# EAGLE design SuperCapacitor Schmatic V2 (EAGLE 9.5.2)
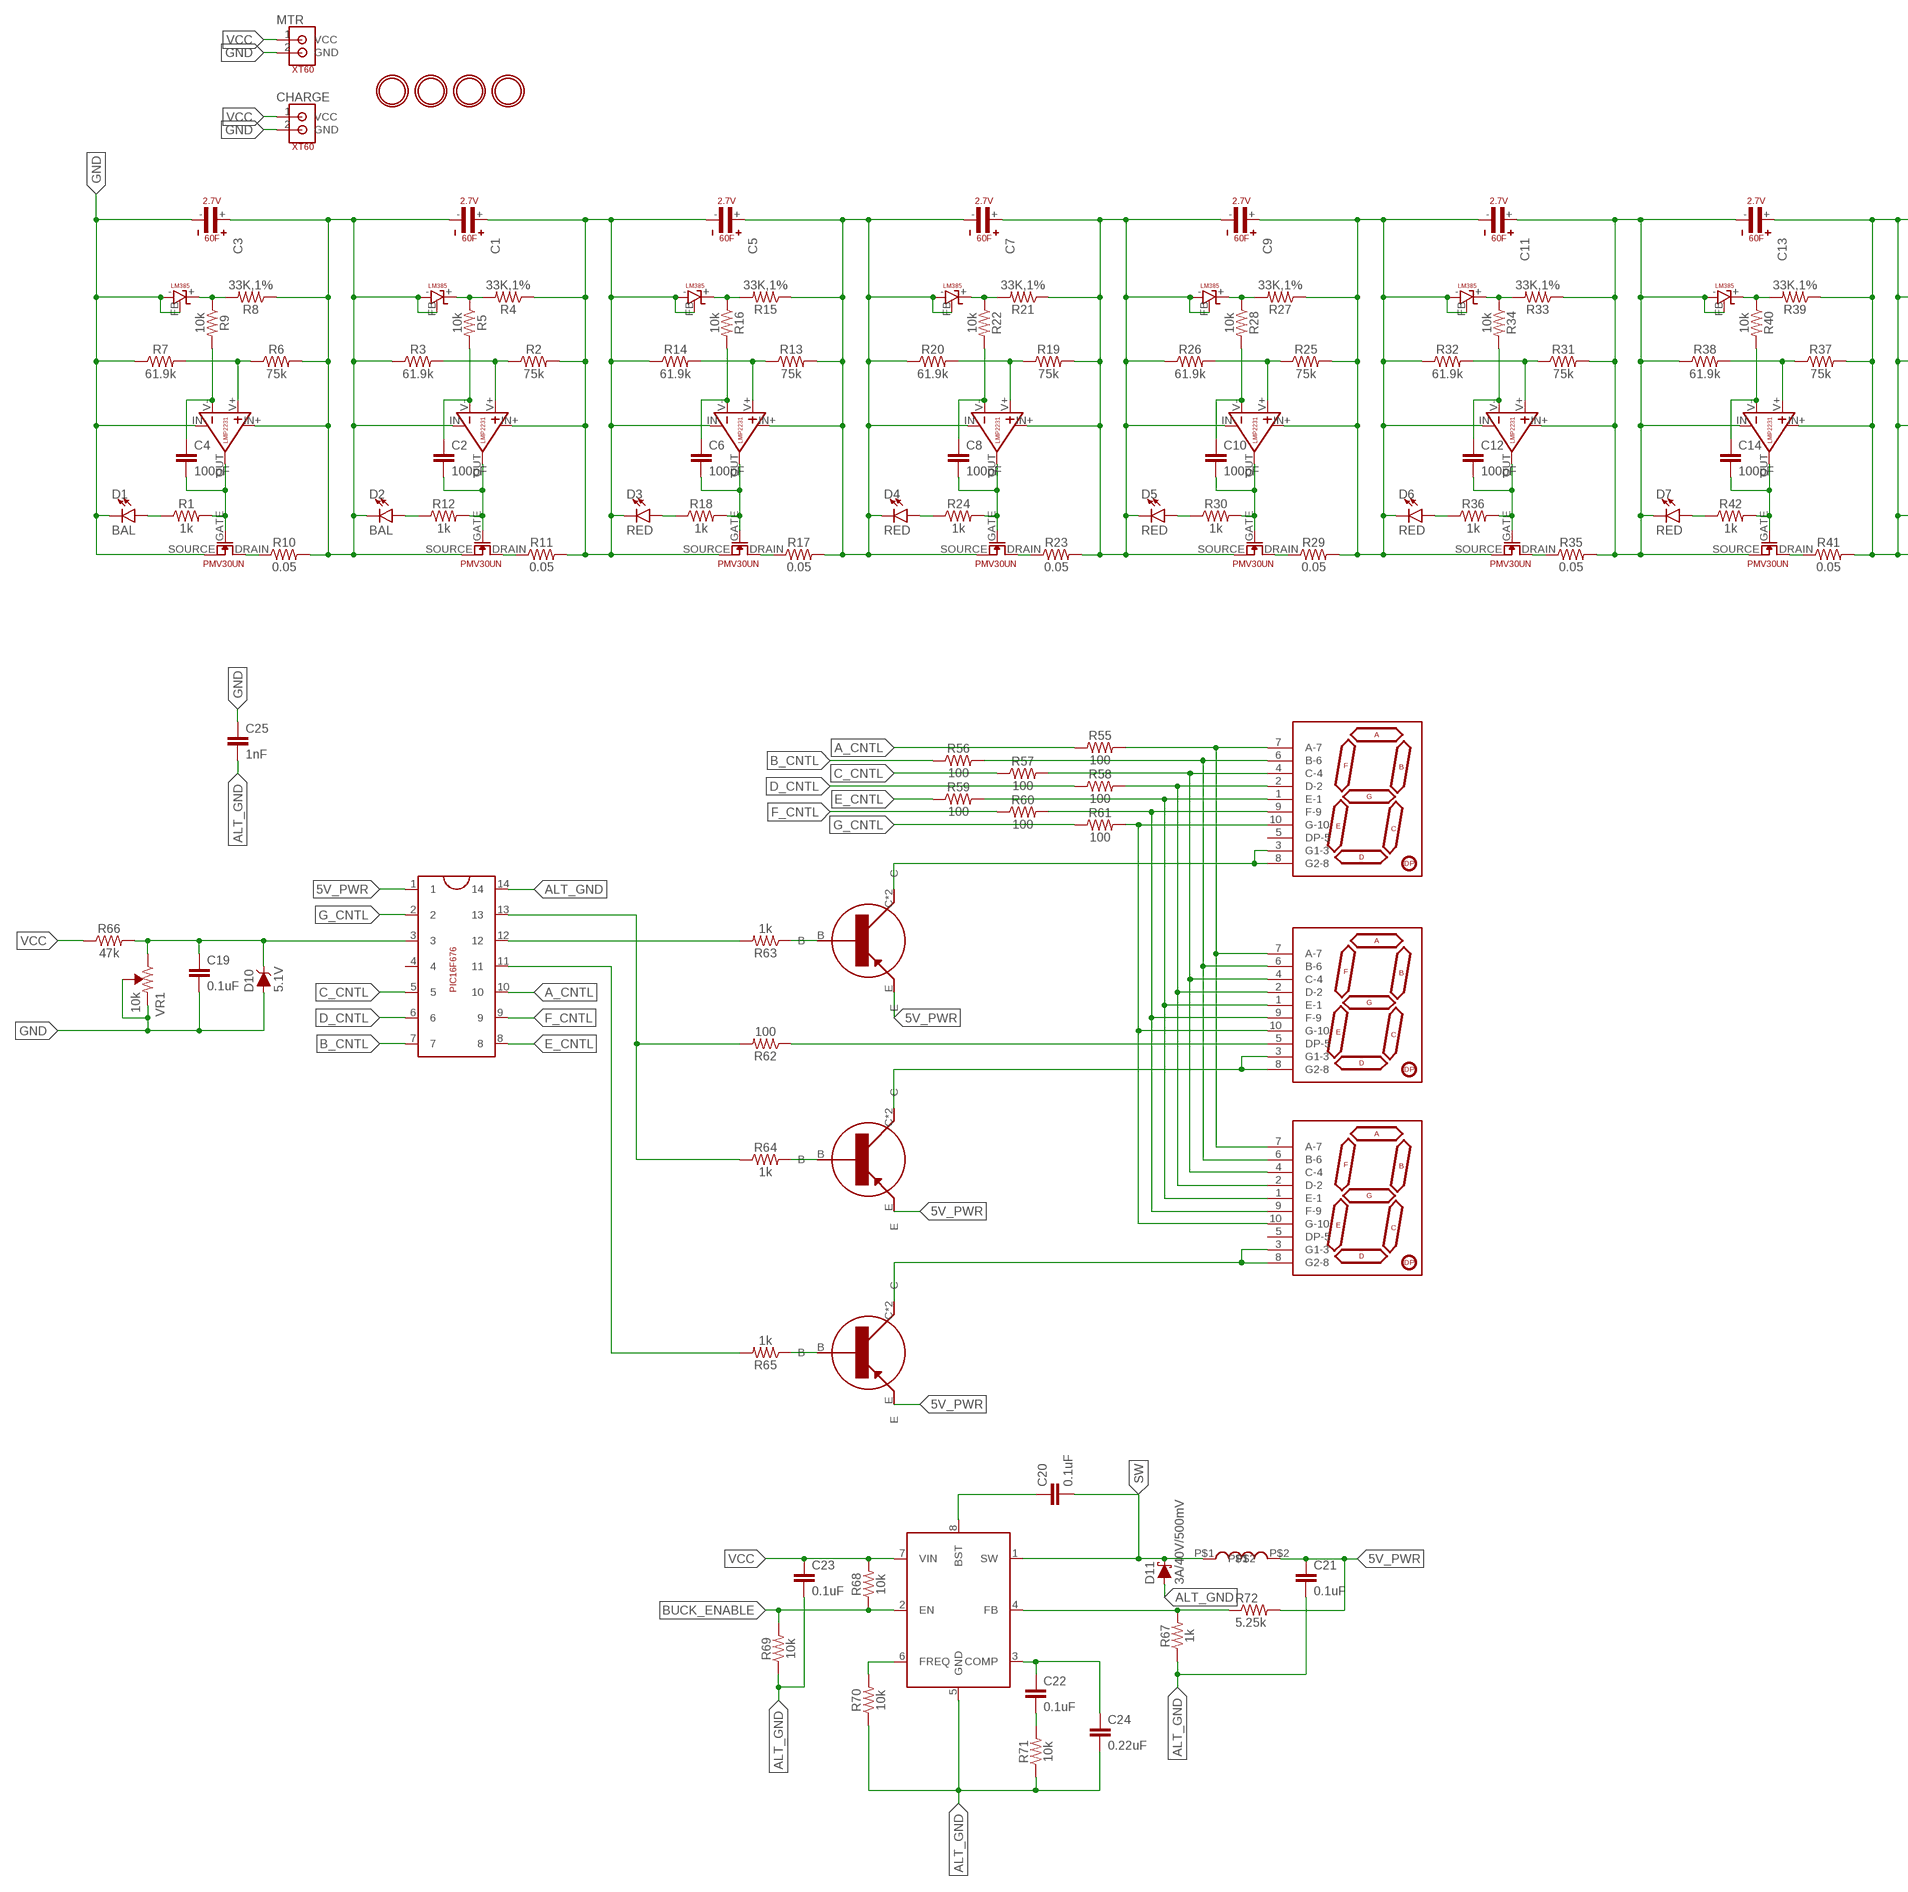
[diagram p0: schematic, sheet 1, part 1 of 2]
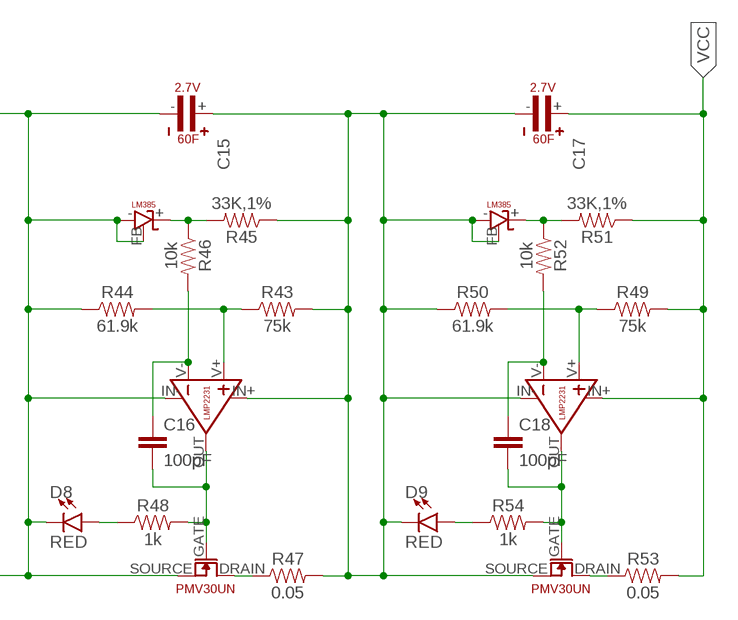
[diagram p1: schematic, sheet 1, part 2 of 2]

## Parts
3.3V_BUCK  SOIC8E  [SOIC127P600X170-9N]
C1  2.7V 60F  2.7V_60F  [2.7V_60F]
C2  100pF  100PF-0603-50V-5%  [0603]
C3  2.7V 60F  2.7V_60F  [2.7V_60F]
C4  100pF  100PF-0603-50V-5%  [0603]
C5  2.7V 60F  2.7V_60F  [2.7V_60F]
C6  100pF  100PF-0603-50V-5%  [0603]
C7  2.7V 60F  2.7V_60F  [2.7V_60F]
C8  100pF  100PF-0603-50V-5%  [0603]
C9  2.7V 60F  2.7V_60F  [2.7V_60F]
C10  100pF  100PF-0603-50V-5%  [0603]
C11  2.7V 60F  2.7V_60F  [2.7V_60F]
C12  100pF  100PF-0603-50V-5%  [0603]
C13  2.7V 60F  2.7V_60F  [2.7V_60F]
C14  100pF  100PF-0603-50V-5%  [0603]
C15  2.7V 60F  2.7V_60F  [2.7V_60F]
C16  100pF  100PF-0603-50V-5%  [0603]
C17  2.7V 60F  2.7V_60F  [2.7V_60F]
C18  100pF  100PF-0603-50V-5%  [0603]
C19  0.1uF  0.1UF-0603-25V-5%  [0603]
C20  0.1uF  0.1UF-0603-25V-(+80/-20%)  [0603]
C21  0.1uF  0.1UF-0603-25V-(+80/-20%)  [0603]
C22  0.1uF  0.1UF-0603-25V-(+80/-20%)  [0603]
C23  0.1uF  0.1UF-0603-25V-(+80/-20%)  [0603]
C24  0.22uF  0.22UF-0603-50V-(-20/+80%)  [0603]
C25  1nF  1.0NF/1000PF-0603-50V-10%  [0603]
CHARGE  XT60  [XT60]
D1  BAL  LED-RED0603  [LED-0603]
D2  BAL  LED-RED0603  [LED-0603]
D3  RED  LED-RED0603  [LED-0603]
D4  RED  LED-RED0603  [LED-0603]
D5  RED  LED-RED0603  [LED-0603]
D6  RED  LED-RED0603  [LED-0603]
D7  RED  LED-RED0603  [LED-0603]
D8  RED  LED-RED0603  [LED-0603]
D9  RED  LED-RED0603  [LED-0603]
D10  5.1V  DIODE-ZENER-MMSZ5232BS  [SOD-323]
D11  3A/40V/500mV  DIODE-SCHOTTKY-B340A  [SMA-DIODE]
MTR  XT60  [XT60]
R1  1k  1KOHM-0603-1/10W-1%  [0603]
R2  75k  75KOHM-0603-1/10W-1%  [0603@1]
R3  61.9k  75KOHM-0603-1/10W-1%  [0603@1]
R4  33K,1%  1MOHM-0603-1/4W-5%  [0603@1]
R5  10k  10KOHM-0603-1/10W-1%  [0603]
R6  75k  75KOHM-0603-1/10W-1%  [0603@1]
R7  61.9k  75KOHM-0603-1/10W-1%  [0603@1]
R8  33K,1%  1MOHM-0603-1/4W-5%  [0603@1]
R9  10k  10KOHM-0603-1/10W-1%  [0603]
R10  0.05  0.05OHM-2512-3W-1%  [2512]
R11  0.05  0.05OHM-2512-3W-1%  [2512]
R12  1k  1KOHM-0603-1/10W-1%  [0603]
R13  75k  75KOHM-0603-1/10W-1%  [0603@1]
R14  61.9k  75KOHM-0603-1/10W-1%  [0603@1]
R15  33K,1%  1MOHM-0603-1/4W-5%  [0603@1]
R16  10k  10KOHM-0603-1/10W-1%  [0603]
R17  0.05  0.05OHM-2512-3W-1%  [2512]
R18  1k  1KOHM-0603-1/10W-1%  [0603]
R19  75k  75KOHM-0603-1/10W-1%  [0603@1]
R20  61.9k  75KOHM-0603-1/10W-1%  [0603@1]
R21  33K,1%  1MOHM-0603-1/4W-5%  [0603@1]
R22  10k  10KOHM-0603-1/10W-1%  [0603]
R23  0.05  0.05OHM-2512-3W-1%  [2512]
R24  1k  1KOHM-0603-1/10W-1%  [0603]
R25  75k  75KOHM-0603-1/10W-1%  [0603@1]
R26  61.9k  75KOHM-0603-1/10W-1%  [0603@1]
R27  33K,1%  1MOHM-0603-1/4W-5%  [0603@1]
R28  10k  10KOHM-0603-1/10W-1%  [0603]
R29  0.05  0.05OHM-2512-3W-1%  [2512]
R30  1k  1KOHM-0603-1/10W-1%  [0603]
R31  75k  75KOHM-0603-1/10W-1%  [0603@1]
R32  61.9k  75KOHM-0603-1/10W-1%  [0603@1]
R33  33K,1%  1MOHM-0603-1/4W-5%  [0603@1]
R34  10k  10KOHM-0603-1/10W-1%  [0603]
R35  0.05  0.05OHM-2512-3W-1%  [2512]
R36  1k  1KOHM-0603-1/10W-1%  [0603]
R37  75k  75KOHM-0603-1/10W-1%  [0603@1]
R38  61.9k  75KOHM-0603-1/10W-1%  [0603@1]
R39  33K,1%  1MOHM-0603-1/4W-5%  [0603@1]
R40  10k  10KOHM-0603-1/10W-1%  [0603]
R41  0.05  0.05OHM-2512-3W-1%  [2512]
R42  1k  1KOHM-0603-1/10W-1%  [0603]
R43  75k  75KOHM-0603-1/10W-1%  [0603@1]
R44  61.9k  75KOHM-0603-1/10W-1%  [0603@1]
R45  33K,1%  1MOHM-0603-1/4W-5%  [0603@1]
R46  10k  10KOHM-0603-1/10W-1%  [0603]
R47  0.05  0.05OHM-2512-3W-1%  [2512]
R48  1k  1KOHM-0603-1/10W-1%  [0603]
R49  75k  75KOHM-0603-1/10W-1%  [0603@1]
R50  61.9k  75KOHM-0603-1/10W-1%  [0603@1]
R51  33K,1%  1MOHM-0603-1/4W-5%  [0603@1]
R52  10k  10KOHM-0603-1/10W-1%  [0603]
R53  0.05  0.05OHM-2512-3W-1%  [2512]
R54  1k  1KOHM-0603-1/10W-1%  [0603]
R55  100  100OHM-0603-1/4W-5%  [0603]
R56  100  100OHM-0603-1/4W-5%  [0603]
R57  100  100OHM-0603-1/4W-5%  [0603]
R58  100  100OHM-0603-1/4W-5%  [0603]
R59  100  100OHM-0603-1/4W-5%  [0603]
R60  100  100OHM-0603-1/4W-5%  [0603]
R61  100  100OHM-0603-1/4W-5%  [0603]
R62  100  100OHM-0603-1/4W-5%  [0603]
R63  1k  1KOHM-0603-1/10W-1%  [0603]
R64  1k  1KOHM-0603-1/10W-1%  [0603]
R65  1k  1KOHM-0603-1/10W-1%  [0603]
R66  47k  47KOHM-0603-1/10W-1%  [0603]
R67  1k  1KOHM-0603-1/10W-1%  [0603]
R68  10k  10KOHM-0603-1/10W-1%  [0603]
R69  10k  10KOHM-0603-1/10W-1%  [0603]
R70  10k  10KOHM-0603-1/10W-1%  [0603]
R71  10k  10KOHM-0603-1/10W-1%  [0603]
R72  5.25k  CRCW08050000Z0EA  [RES_0805]
U$1  LMP2231  [LMP2231_SOT23_5]
U$2  LM385  [LM385_SOT23]
U$3  PMV30UN_MOS  [PMV30UN_SOT23]
U$4  LMP2231  [LMP2231_SOT23_5]
U$5  LM385  [LM385_SOT23]
U$6  PMV30UN_MOS  [PMV30UN_SOT23]
U$7  LMP2231  [LMP2231_SOT23_5]
U$8  LM385  [LM385_SOT23]
U$9  PMV30UN_MOS  [PMV30UN_SOT23]
U$10  LMP2231  [LMP2231_SOT23_5]
U$11  LM385  [LM385_SOT23]
U$12  PMV30UN_MOS  [PMV30UN_SOT23]
U$13  LMP2231  [LMP2231_SOT23_5]
U$14  LM385  [LM385_SOT23]
U$15  PMV30UN_MOS  [PMV30UN_SOT23]
U$16  LMP2231  [LMP2231_SOT23_5]
U$17  LM385  [LM385_SOT23]
U$18  PMV30UN_MOS  [PMV30UN_SOT23]
U$19  LMP2231  [LMP2231_SOT23_5]
U$20  LM385  [LM385_SOT23]
U$21  PMV30UN_MOS  [PMV30UN_SOT23]
U$22  LMP2231  [LMP2231_SOT23_5]
U$23  LM385  [LM385_SOT23]
U$24  PMV30UN_MOS  [PMV30UN_SOT23]
U$25  LMP2231  [LMP2231_SOT23_5]
U$26  LM385  [LM385_SOT23]
U$27  PMV30UN_MOS  [PMV30UN_SOT23]
U$28  PZT3906  [SOT_223]
U$29  PZT3906  [SOT_223]
U$30  M5  [M5]
U$31  M5  [M5]
U$32  M5  [M5]
U$33  M5  [M5]
U$34  PZT3906  [SOT_223]
U$35  DSM7T  [7-SEGMENT_SMD]
U$36  DSM7T  [7-SEGMENT_SMD]
U$37  DSM7T  [7-SEGMENT_SMD]
U$38  PIC16F676  [PIC16F676]
U$39  4.7UH_INDUCTOR  [4.7UH_INDUCTOR]
VR1  10k  TRIMPOT-SMD-3MM-OPEN-1/10W-25%  [TRIMPOT-SMD-TC33X]

## Nets
1 [discharge]: R17.P$1 U$9.DRAIN
5V_PWR: C21.1 R72.2 U$28.E U$29.E U$34.E U$38.1 U$39.P$2
A_CNTL: R55.1 U$38.10
ALT_GND [discharge]: 3.3V_BUCK.5(GND) C21.2 C23.2 C24.2 C25.2 D11.A R67.1 R69.1 R70.1 R71.1 U$38.14
B_CNTL: R56.1 U$38.7
BUCK_ENABLE: 3.3V_BUCK.2(EN) R68.1 R69.2
C_CNTL: R57.1 U$38.5
D_CNTL: R58.1 U$38.6
E_CNTL: R59.1 U$38.8
F_CNTL: R60.1 U$38.9
G_CNTL: R61.1 U$38.2
GND [discharge]: C3.- C19.2 C25.1 CHARGE.2(GND) D1.C D10.A MTR.2(GND) R7.1 U$4.IN- U$5.- U$5.FB U$6.SOURCE VR1.2(WIPER) VR1.3(CCW)
N$1: D1.A R1.1
N$2: U$29.C U$29.C2(C) U$37.3(G1-3) U$37.8(G2-8)
N$3: C2.2 R12.2 U$1.OUT U$3.GATE
N$4 [discharge]: C1.- C3.+ D2.C R3.1 R6.2 R8.1 R10.P$2 U$1.IN- U$2.- U$2.FB U$3.SOURCE U$4.IN+
N$5: R2.1 R3.2 U$1.V+
N$6: C2.1 R5.2 U$1.V-
N$7: R4.2 R5.1 U$2.+
N$8: U$34.C U$34.C2(C) U$36.3(G1-3) U$36.8(G2-8)
N$9: C4.2 R1.2 U$4.OUT U$6.GATE
N$10: R65.1 U$34.B
N$11: R6.1 R7.2 U$4.V+
N$12: C4.1 R9.2 U$4.V-
N$13: R8.2 R9.1 U$5.+
N$14 [discharge]: R10.P$1 U$6.DRAIN
N$15 [discharge]: R11.P$1 U$3.DRAIN
N$16: D2.A R12.1
N$17: R63.1 U$28.B
N$18: C6.2 R18.2 U$7.OUT U$9.GATE
N$19 [discharge]: C1.+ C5.- D3.C R2.2 R4.1 R11.P$2 R14.1 U$1.IN+ U$7.IN- U$8.- U$8.FB U$9.SOURCE
N$20: R13.1 R14.2 U$7.V+
N$21: C6.1 R16.2 U$7.V-
N$22: R15.2 R16.1 U$8.+
N$23: R62.1 U$37.5(DP-5)
N$24: D3.A R18.1
N$25: R62.2 R64.1 U$38.13
N$26: C8.2 R24.2 U$10.OUT U$12.GATE
N$27 [discharge]: C5.+ C7.- D4.C R13.2 R15.1 R17.P$2 R20.1 U$7.IN+ U$10.IN- U$11.- U$11.FB U$12.SOURCE
N$28: R19.1 R20.2 U$10.V+
N$29: C8.1 R22.2 U$10.V-
N$30: R21.2 R22.1 U$11.+
N$31 [discharge]: R23.P$1 U$12.DRAIN
N$32: D4.A R24.1
N$33: R63.2 U$38.12
N$34: C10.2 R30.2 U$13.OUT U$15.GATE
N$35 [discharge]: C7.+ C9.- D5.C R19.2 R21.1 R23.P$2 R26.1 U$10.IN+ U$13.IN- U$14.- U$14.FB U$15.SOURCE
N$36: R25.1 R26.2 U$13.V+
N$37: C10.1 R28.2 U$13.V-
N$38: R27.2 R28.1 U$14.+
N$39 [discharge]: R29.P$1 U$15.DRAIN
N$40: D5.A R30.1
N$41: C19.1 D10.C R66.2 U$38.3 VR1.1(CW)
N$42: C12.2 R36.2 U$16.OUT U$18.GATE
N$43 [discharge]: C9.+ C11.- D6.C R25.2 R27.1 R29.P$2 R32.1 U$13.IN+ U$16.IN- U$17.- U$17.FB U$18.SOURCE
N$44: R31.1 R32.2 U$16.V+
N$45: C12.1 R34.2 U$16.V-
N$46: R33.2 R34.1 U$17.+
N$47 [discharge]: R35.P$1 U$18.DRAIN
N$48: D6.A R36.1
N$49: R65.2 U$38.11
N$50: C14.2 R42.2 U$19.OUT U$21.GATE
N$51 [discharge]: C11.+ C13.- D7.C R31.2 R33.1 R35.P$2 R38.1 U$16.IN+ U$19.IN- U$20.- U$20.FB U$21.SOURCE
N$52: R37.1 R38.2 U$19.V+
N$53: C14.1 R40.2 U$19.V-
N$54: R39.2 R40.1 U$20.+
N$55 [discharge]: R41.P$1 U$21.DRAIN
N$56: D7.A R42.1
N$57: U$28.C U$28.C2(C) U$35.3(G1-3) U$35.8(G2-8)
N$58: C16.2 R48.2 U$22.OUT U$24.GATE
N$59: C13.+ C15.- D8.C R37.2 R39.1 R41.P$2 R44.1 U$19.IN+ U$22.IN- U$23.- U$23.FB U$24.SOURCE
N$60: R43.1 R44.2 U$22.V+
N$61: C16.1 R46.2 U$22.V-
N$62: R45.2 R46.1 U$23.+
N$63 [discharge]: R47.P$1 U$24.DRAIN
N$64: D8.A R48.1
N$65: R64.2 U$29.B
N$66: C18.2 R54.2 U$25.OUT U$27.GATE
N$67 [discharge]: C15.+ C17.- D9.C R43.2 R45.1 R47.P$2 R50.1 U$22.IN+ U$25.IN- U$26.- U$26.FB U$27.SOURCE
N$68: R49.1 R50.2 U$25.V+
N$69: C18.1 R52.2 U$25.V-
N$70: R51.2 R52.1 U$26.+
N$71 [discharge]: R53.P$1 U$27.DRAIN
N$72: D9.A R54.1
N$73: R55.2 U$35.7(A-7) U$36.7(A-7) U$37.7(A-7)
N$74: R56.2 U$35.6(B-6) U$36.6(B-6) U$37.6(B-6)
N$75: R57.2 U$35.4(C-4) U$36.4(C-4) U$37.4(C-4)
N$76: R58.2 U$35.2(D-2) U$36.2(D-2) U$37.2(D-2)
N$77: R59.2 U$35.1(E-1) U$36.1(E-1) U$37.1(E-1)
N$78: R60.2 U$35.9(F-9) U$36.9(F-9) U$37.9(F-9)
N$79: R61.2 U$35.10(G-10) U$36.10(G-10) U$37.10(G-10)
N$81: 3.3V_BUCK.4(FB) R67.2 R72.1
N$82: 3.3V_BUCK.8(BST) C20.1
N$83: 3.3V_BUCK.6(FREQ) R70.2
N$84: 3.3V_BUCK.3(COMP) C22.1 C24.1
N$85: C22.2 R71.2
SW: 3.3V_BUCK.1(SW) C20.2 D11.C U$39.P$1
VCC [discharge]: 3.3V_BUCK.7(VIN) C17.+ C23.1 CHARGE.1(VCC) MTR.1(VCC) R49.2 R51.1 R53.P$2 R66.1 R68.2 U$25.IN+
Unconnected: U$35.5(DP-5) U$36.5(DP-5) U$38.4

## Library data of the parts
3.3V_BUCK = SOIC127P600X170-9N:SOIC8E
C1 C3 C5 C7 C9 C11 C13 C15 C17 = personal Made:2.7V_60F
C2 C4 C6 C8 C10 C12 C14 C16 C18 = SparkFun-Capacitors:100PF: 100pF/0.1nF ceramic capacitors A capacitor is a passive two-terminal electrical component used to store electrical energy temporarily in an electric field.; PROD_ID: CAP-07883
C19 = SparkFun-Capacitors:0.1UF: 0.1µF ceramic capacitors A capacitor is a passive two-terminal electrical component used to store electrical energy temporarily in an electric field.; PROD_ID: CAP-08604
C20-C23 = SparkFun-Capacitors:0.1UF: 0.1µF ceramic capacitors A capacitor is a passive two-terminal electrical component used to store electrical energy temporarily in an electric field.; PROD_ID: CAP-00810
C24 = SparkFun-Capacitors:0.22UF: 0.22µF ceramic capacitors A capacitor is a passive two-terminal electrical component used to store electrical energy temporarily in an electric field.; PROD_ID: CAP-09885
C25 = SparkFun-Capacitors:1.0NF/1000PF: 1nF/1,000pF ceramic capacitors A capacitor is a passive two-terminal electrical component used to store electrical energy temporarily in an electric field.; PROD_ID: CAP-07886
CHARGE MTR = NewKevinMade:XT60
D1 D2 = SparkFun-LED:LED-RED: Red SMD LED Used in manufacturing of most products at SparkFun Packages: 0603 - SMD 0603 package [Product Link] <http://docs.avagotech.com/docs/AV02-0551EN> 0603 SMART - SMD 0603 SMART package ( more efficient and expensive)[Product Link] <http://www.osram-os.com/Graphics/XPic2/00077099_0.pdf> 1206 - SMD1206 package [Product Link] <https://www.sparkfun.com/datasheets/DevTools/LilyPad/Q150OVS4.pdff> SparkFun Products: Pro Mini 328 -5V <https://www.sparkfun.com/products/821> RedBoard <https://www.sparkfun.com/products/12757> IOIO-OTG <https://www.sparkfun.com/products/13613>; PROD_ID: DIO-00819; VALUE: RED
D3-D9 = SparkFun-LED:LED-RED: Red SMD LED Used in manufacturing of most products at SparkFun Packages: 0603 - SMD 0603 package [Product Link] <http://docs.avagotech.com/docs/AV02-0551EN> 0603 SMART - SMD 0603 SMART package ( more efficient and expensive)[Product Link] <http://www.osram-os.com/Graphics/XPic2/00077099_0.pdf> 1206 - SMD1206 package [Product Link] <https://www.sparkfun.com/datasheets/DevTools/LilyPad/Q150OVS4.pdff> SparkFun Products: Pro Mini 328 -5V <https://www.sparkfun.com/products/821> RedBoard <https://www.sparkfun.com/products/12757> IOIO-OTG <https://www.sparkfun.com/products/13613>; PROD_ID: DIO-00819
D10 = SparkFun-DiscreteSemi:DIODE-ZENER: Zener Diode A Zener diode allows current to flow from its anode to its cathode like a normal semiconductor diode, but it also permits current to flow in the reverse direction when its "Zener voltage" is reached. - WIkipedia; PROD_ID: DIO-12442; VALUE: 5.6V
D11 = SparkFun-DiscreteSemi:DIODE-SCHOTTKY: Schottky diode A Schottky diode is a semiconductor diode which has a low forward voltage drop and a very fast switching action.; PROD_ID: DIO-09886
R1 R12 R18 R24 R30 R36 R42 R48 R54 R63-R65 R67 = SparkFun-Resistors:1KOHM: 1kΩ resistor A resistor is a passive two-terminal electrical component that implements electrical resistance as a circuit element. Resistors act to reduce current flow, and, at the same time, act to lower voltage levels within circuits. - Wikipedia; PROD_ID: RES-07856
R2 R3 R6 R7 R13 R14 R19 R20 R25 R26 R31 R32 R37 R38 R43 R44 R49 R50 = SparkFun-Resistors:75KOHM: 75Ω resistor A resistor is a passive two-terminal electrical component that implements electrical resistance as a circuit element. Resistors act to reduce current flow, and, at the same time, act to lower voltage levels within circuits. - Wikipedia; PROD_ID: RES-09737; VALUE: 75
R4 R8 R15 R21 R27 R33 R39 R45 R51 = SparkFun-Resistors:1MOHM: 1MΩ resistor A resistor is a passive two-terminal electrical component that implements electrical resistance as a circuit element. Resistors act to reduce current flow, and, at the same time, act to lower voltage levels within circuits. - Wikipedia; PROD_ID: RES-07868; VALUE: 1M
R5 R9 R16 R22 R28 R34 R40 R46 R52 R68-R71 = SparkFun-Resistors:10KOHM: 10kΩ resistor A resistor is a passive two-terminal electrical component that implements electrical resistance as a circuit element. Resistors act to reduce current flow, and, at the same time, act to lower voltage levels within circuits. - Wikipedia; PROD_ID: RES-00824
R10 R11 R17 R23 R29 R35 R41 R47 R53 = SparkFun-Resistors:0.05OHM: 0.05Ω resistor A resistor is a passive two-terminal electrical component that implements electrical resistance as a circuit element. Resistors act to reduce current flow, and, at the same time, act to lower voltage levels within circuits. - Wikipedia; PROD_ID: RES-13771
R55-R62 = SparkFun-Resistors:100OHM: 100Ω resistor A resistor is a passive two-terminal electrical component that implements electrical resistance as a circuit element. Resistors act to reduce current flow, and, at the same time, act to lower voltage levels within circuits. - Wikipedia; PROD_ID: RES-12438
R66 = SparkFun-Resistors:47KOHM: 47kΩ resistor A resistor is a passive two-terminal electrical component that implements electrical resistance as a circuit element. Resistors act to reduce current flow, and, at the same time, act to lower voltage levels within circuits. - Wikipedia; PROD_ID: RES-07871
R72 = Resistor_Capacitor:CRCW08050000Z0EA: RES SMD 0 OHM JUMPER 1/8W 0805 Manufacturer's datasheet <http://www.vishay.com/docs/20035/dcrcwe3.pdf>; CREATED_BY: PCBLayout.com; DIGIKEY_PART_NUMBER: 541-0.0ATR-ND; MANUFACTURER: Vishay Dale; MPN: CRCW08050000Z0EA; PACKAGE: SMD 0805
U$1 U$4 U$7 U$10 U$13 U$16 U$19 U$22 U$25 = personal Made:LMP2231
U$2 U$5 U$8 U$11 U$14 U$17 U$20 U$23 U$26 = personal Made:LM385
U$3 U$6 U$9 U$12 U$15 U$18 U$21 U$24 U$27 = personal Made:PMV30UN_MOS
U$28 U$29 U$34 = Custom:PZT3906
U$30-U$33 = NewKevinMade:M5
U$35-U$37 = Custom:DSM7T
U$38 = Custom:PIC16F676
U$39 = Custom:4.7UH_INDUCTOR
VR1 = SparkFun-Resistors:TRIMPOT: Trimming Potentiometer (Trimpot) Three-terminal potentiometers, with an adjustable wiper and two adjustable resistors. A pot can be used to create a configurable voltage divider, or as a variable resistor. "Trimpots" are a subset of potentiometers, usually intended for "set-and-forget" applications. They're often more delicate than standard potentiometers - rated for fewer turns. Variants PTH-KNOB - PTH Trimpot w/ finger-adjustable knob Trimpot 10K with Knob <https://www.sparkfun.com/products/9806> (COM-09806) Datasheet <http://www.sparkfun.com/datasheets/Components/General/TSR-3386.pdf> SMD-3MM-CLOSED-FRAME - SMD 3mm Square Closed-Frame Trimpot Used on e.g. EasyDriver - Stepper Motor Driver <https://www.sparkfun.com/products/12779> Datasheet <http://www.bitechnologies.com/pdfs/22.pdf> (22AR10KTR) SMD-5MM - SMD 5mm Square Closed-Frame Trimpot Used on e.g. IOIO-OTG - V2.2 <https://www.sparkfun.com/products/13613> Datasheet <http://www.vishay.com/docs/51008/ts53.pdf> (TS53YL502MR10) SMD-3MM-1/10W-25% - 3mm Square Open-Frame Trimpot Used on e.g. SparkFun Shapeoko <https://www.sparkfun.com/products/13899> Datasheet <http://www.bourns.com/docs/Product-Datasheets/TC33.pdf> (TC33X-2-103E); PROD_ID: RES-12428

## Net classes
1 discharge: width 0.305 mm, drill 0.305 mm, clearance 0.152 mm

## Board
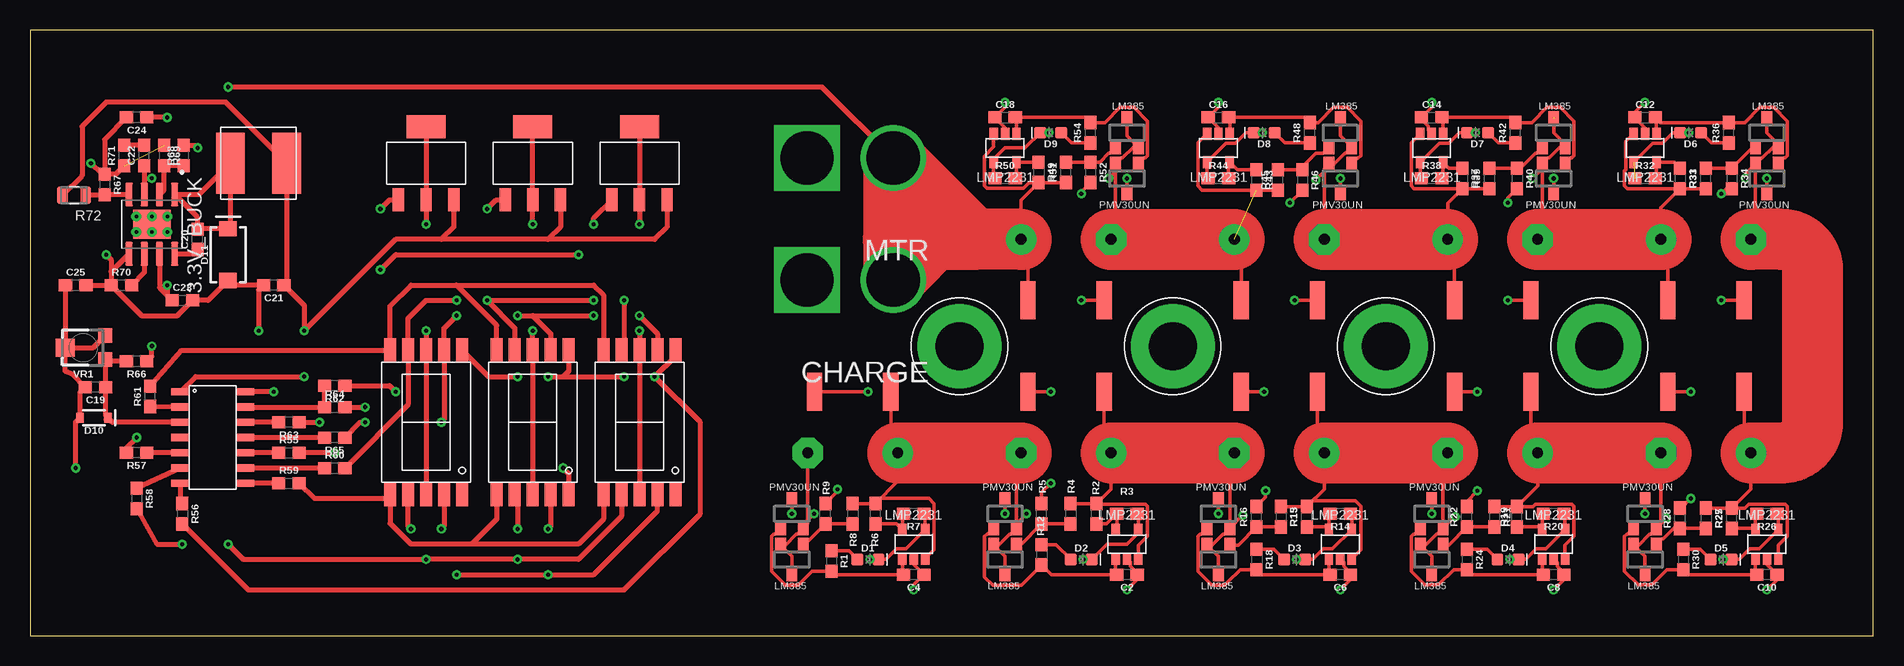
[diagram p2: board, top side]
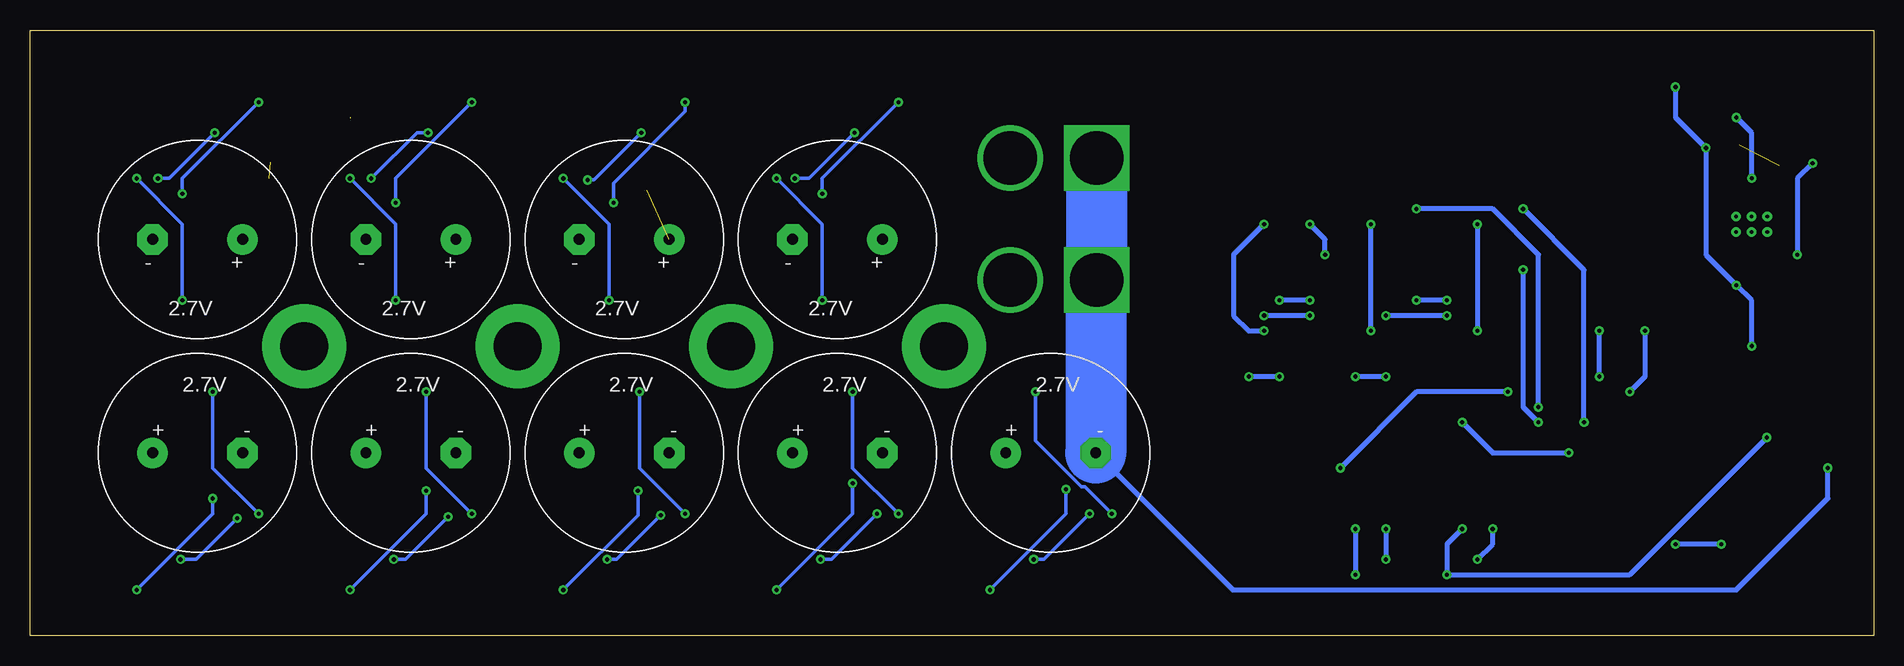
[diagram p3: board, bottom side, seen from below]

Size 153.65 x 50.47 mm. Coordinates in mm from the lower left corner, seen from the top.
Outline: 0,0 153.65,0 153.65,50.47 0,50.47 0,0
Copper layers (1*16): Top 0.035mm / dielectric 1.5mm / Bottom 0.035mm
Design rules "default": minimum track width 6mil, minimum drill 0.35mm, track to track 6mil, track to pad 6mil, pad to pad 6mil, via to via 6mil, smd to smd 6mil, copper to edge 40mil, drill to drill 6mil, minimum pad ring 10mil, minimum via ring 8mil, stop-mask expansion 4mil, vias tented up to drill 0mil, thermal gap 10mil

### Footprints (pad centres in the part's own frame; a part is rotated, then mirrored left to right if it is on the bottom)
SOIC127P600X170-9N = smd 1.97 x 0.6: 1 -2.475,1.905; 2 -2.475,0.635; 3 -2.475,-0.635; 4 -2.475,-1.905; 5 2.475,-1.905; 6 2.475,-0.635; 7 2.475,0.635; 8 2.475,1.905 | smd 2.4 x 3.1: 9 0,0 | drill 0.3 pad 0.4: V1 -0.65,1.3; V2 0.65,1.3; V3 -0.65,0; V4 0.65,0; V5 -0.65,-1.3; V6 0.65,-1.3
2.7V_60F = drill 0.9 pad 2.54: + -3.75,0 | drill 0.9 pad 2.54 octagon: - 3.75,0
0603 = smd 1.1 x 1: 1 -0.85,0; 2 0.85,0
XT60 = drill 4.45: 1 -7.2,7.2 | drill 4.45 square: 2 0,7.2
LED-0603 = smd 1 x 1: A -0.877,0; C 0.877,0
SOD-323 = smd 0.63 x 0.83: A 1.15,0; C -1.15,0
SMA-DIODE = smd 1.27 x 1.47: A -2.15,0; C 2.15,0
0603@1 = smd 1.1 x 1: 1 -0.85,0; 2 0.85,0
2512 = smd 1.27 x 3.175: P$1 -3.175,0; P$2 3.175,0
RES_0805 = smd 0.87 x 1.42: 1 -0.975,0; 2 0.975,0
LMP2231_SOT23_5 = smd 0.7 x 1: IN+ 0.95,-1.2; IN- 0.95,1.2; OUT -0.95,-1.2; V+ -0.95,1.2; V- 0,-1.2
LM385_SOT23 = smd 0.9 x 1.2: + -0.95,-1.2; - 0.95,-1.2; FB 0,1.2
PMV30UN_SOT23 = smd 0.9 x 1.2: DRAIN 0,1.2; GATE -0.95,-1.2; SOURCE 0.95,-1.2
SOT_223 = smd 0.95 x 1.9: B -2.3,-3.05; C 0,-3.05; E 2.3,-3.05 | smd 3.25 x 1.9: C2 0,3.05
M5 = drill 4 pad 7: P$1 0,0
7-SEGMENT_SMD = smd 1 x 2: 1 -3,-6; 2 -1.5,-6; 3 0,-6; 4 1.5,-6; 5 3,-6; 6 3,6; 7 1.5,6; 8 0,6; 9 -1.5,6; 10 -3,6
PIC16F676 = smd 0.6 x 1.5: 1 -3.81,-2.7; 2 -2.54,-2.7; 3 -1.27,-2.7; 4 0,-2.7; 5 1.27,-2.7; 6 2.54,-2.7; 7 3.81,-2.7; 8 3.81,2.7; 9 2.54,2.7; 10 1.27,2.7; 11 0,2.7; 12 -1.27,2.7; 13 -2.54,2.7; 14 -3.81,2.7
4.7UH_INDUCTOR = smd 2.4 x 5.1: P$1 -2.35,0; P$2 2.35,0
TRIMPOT-SMD-TC33X = smd 1.2 x 1.2: 1 -1,-1.825; 3 1,-1.825 | smd 1.5 x 1.6: 2 0,1.5

### Placement (x,y rotation side)
3.3V_BUCK  10.16,34.29 270 top
C1  86.36,15.24 0 bottom
C2  91.44,5.08 180 top
C3  68.58,15.24 0 bottom
C4  73.66,5.08 180 top
C5  104.14,15.24 0 bottom
C6  109.22,5.08 180 top
C7  121.92,15.24 0 bottom
C8  127,5.08 180 top
C9  139.7,15.24 0 bottom
C10  144.78,5.08 180 top
C11  139.7,33.02 180 bottom
C12  134.62,43.18 0 top
C13  121.92,33.02 180 bottom
C14  116.84,43.18 0 top
C15  104.14,33.02 180 bottom
C16  99.06,43.18 0 top
C17  86.36,33.02 180 bottom
C18  81.28,43.18 0 top
C19  5.46,20.7 180 top
C20  13.97,33.02 90 top
C21  20.32,29.21 180 top
C22  9.53,40.01 90 top
C23  12.7,27.94 0 top
C24  8.89,43.18 180 top
C25  3.81,29.21 0 top
CHARGE  64.77,36.83 180 top
D1  69.85,6.35 0 top
D2  87.63,6.35 0 top
D3  105.41,6.35 0 top
D4  123.19,6.35 0 top
D5  140.97,6.35 0 top
D6  138.43,41.91 180 top
D7  120.65,41.91 180 top
D8  102.87,41.91 180 top
D9  85.09,41.91 180 top
D10  5.33,18.16 180 top
D11  16.51,31.75 90 top
MTR  64.77,46.99 180 top
R1  66.8,6.22 270 top
R2  88.9,10.16 90 top
R3  91.44,10.16 180 top
R4  86.74,10.16 270 top
R5  84.33,10.16 90 top
R6  70.48,10.16 90 top
R7  73.66,10.16 180 top
R8  68.58,10.16 270 top
R9  66.29,10.16 90 top
R10  68.58,20.32 0 top
R11  86.36,20.32 0 top
R12  84.33,6.73 270 top
R13  106.43,9.91 90 top
R14  109.22,10.16 180 top
R15  104.27,9.91 270 top
R16  102.23,9.91 90 top
R17  104.14,20.32 0 top
R18  102.23,6.35 270 top
R19  123.95,9.91 90 top
R20  127,10.16 180 top
R21  122.05,9.91 270 top
R22  119.76,9.91 90 top
R23  121.92,20.32 0 top
R24  119.76,6.35 270 top
R25  141.86,9.78 90 top
R26  144.78,10.16 180 top
R27  139.7,9.78 270 top
R28  137.54,9.78 90 top
R29  139.7,20.32 0 top
R30  137.79,6.35 270 top
R31  137.54,38.1 270 top
R32  134.62,38.1 0 top
R33  139.7,38.1 90 top
R34  141.86,38.1 270 top
R35  139.7,27.94 180 top
R36  141.6,41.91 90 top
R37  119.38,38.1 270 top
R38  116.84,38.1 0 top
R39  121.67,38.1 90 top
R40  123.95,38.1 270 top
R41  121.92,27.94 180 top
R42  123.83,41.91 90 top
R43  102.23,37.97 270 top
R44  99.06,38.1 0 top
R45  104.01,37.97 90 top
R46  106.05,37.97 270 top
R47  104.14,27.94 180 top
R48  106.68,41.91 90 top
R49  84.07,38.61 270 top
R50  81.28,38.1 0 top
R51  86.36,38.61 90 top
R52  88.39,38.61 270 top
R53  86.36,27.94 180 top
R54  88.39,41.91 90 top
R55  21.59,15.24 0 top
R56  12.7,10.16 270 top
R57  8.89,15.24 180 top
R58  8.89,11.43 270 top
R59  21.59,12.7 0 top
R60  25.4,13.97 0 top
R61  10.03,19.94 90 top
R62  25.4,20.83 180 top
R63  21.59,17.78 180 top
R64  25.4,19.05 0 top
R65  25.4,16.51 180 top
R66  8.89,22.86 180 top
R67  6.22,37.59 270 top
R68  12.83,40.01 90 top
R69  11.18,40.01 270 top
R70  7.62,29.21 0 top
R71  7.87,40.01 90 top
R72  3.68,36.7 180 top
U$1  91.44,7.62 0 top
U$2  81.28,6.35 180 top
U$3  81.28,10.16 0 top
U$4  73.66,7.62 0 top
U$5  63.5,6.35 180 top
U$6  63.5,10.16 0 top
U$7  109.22,7.62 0 top
U$8  99.06,6.35 180 top
U$9  99.06,10.16 0 top
U$10  127,7.62 0 top
U$11  116.84,6.35 180 top
U$12  116.84,10.16 0 top
U$13  144.78,7.62 0 top
U$14  134.62,6.35 180 top
U$15  134.62,10.16 0 top
U$16  134.62,40.64 180 top
U$17  144.78,41.91 0 top
U$18  144.78,38.1 180 top
U$19  116.84,40.64 180 top
U$20  127,41.91 0 top
U$21  127,38.1 180 top
U$22  99.06,40.64 180 top
U$23  109.22,41.91 0 top
U$24  109.22,38.1 180 top
U$25  81.28,40.64 180 top
U$26  91.44,41.91 0 top
U$27  91.44,38.1 180 top
U$28  33.02,39.37 0 top
U$29  41.91,39.37 0 top
U$30  113.03,24.13 0 top
U$31  130.81,24.13 0 top
U$32  77.47,24.13 0 top
U$33  95.25,24.13 0 top
U$34  50.8,39.37 0 top
U$35  33.02,17.78 0 top
U$36  50.8,17.78 0 top
U$37  41.91,17.78 0 top
U$38  15.24,16.51 270 top
U$39  19.05,39.37 0 top
VR1  4.45,24 90 top

### Tracks (layer width: path | path; a pad name or v marks a point on that pad's centre or on a via)
1  (via drill 0.35)
  Top 0.305: U$9.DRAIN v99.06,10.16 | v102.87,20.32 R17.P$1
  Bottom 0.305: v99.06,10.16 102.87,13.97 v102.87,20.32
5V_PWR  (via drill 0.35)
  Top 0.406: U$38.1 13.81,21.59 v22.86,21.59 | U$34.E 53.1,34.05 52.07,33.02 43.18,33.02 | 43.18,33.02 34.29,33.02 | 34.29,33.02 30.48,33.02 v22.86,25.4 22.86,27.52 C21.1 21.4,29.44 U$39.P$2 | U$28.E 35.32,34.05 34.29,33.02 | U$29.E 44.21,34.05 43.18,33.02 | R72.2 4.35,38.34 4.35,42.45 6.35,44.45 16.32,44.45 U$39.P$2 | 21.4,39.56 U$39.P$2
  Bottom 0.406: v22.86,21.59 v22.86,25.4
A_CNTL
  Top 0.406: R55.1 U$38.10
ALT_GND  (via drill 0.35)  (1 unrouted)
  Top 0.406: 3.3V_BUCK.5 6.77,30.33 | 6.77,30.33 R70.1 | R70.1 9.31,26.67 12.28,26.67 C23.2 14.85,27.94 D11.A 16.9,29.21 C21.2 19.05,28.79 v19.05,25.4 | R67.1 6.01,38.44 v5.08,39.37 | v6.35,31.75 6.77,31.33 6.77,30.33 | R71.1 7.16,38.44 R67.1 | C24.2 6.22,41.36 R67.1 | v20.32,20.32 U$38.14 | C25.2 R70.1
  Bottom 0.406: v5.08,39.37 6.35,38.1 v6.35,31.75 | v19.05,25.4 19.05,21.59 v20.32,20.32
B_CNTL
  Top 0.406: U$38.7 12.54,11.17 R56.1
BUCK_ENABLE
  Top 0.406: 3.3V_BUCK.2 11.18,37.15 R69.2 R68.1
C_CNTL
  Top 0.406: U$38.5 R57.1
D_CNTL
  Top 0.406: U$38.6 R58.1
E_CNTL
  Top 0.406: R59.1 U$38.8
F_CNTL
  Top 0.406: R60.1 U$38.9
G_CNTL
  Top 0.406: U$38.2 R61.1
GND  (via drill 0.35)
  Top 0.305: C3.- 64.83,9.34 U$6.SOURCE | U$6.SOURCE 63.95,8.46 63.87,8.46 62.97,7.55 U$5.- 63.5,6.6 U$5.FB | U$6.SOURCE 64.45,9.27 v65.34,10.16 | v70,6.35 D1.C 71.36,6.35 72.23,7.22 73.02,7.22 U$4.IN- 74.61,10.06 R7.1
  Top 0.406: VR1.2 2.94,22.01 3.03,22 3.55,21.76 C19.2 4.18,20.27 D10.A 3.81,17.79 v3.81,13.97 | VR1.3 5.27,24 VR1.2 | C25.1 2.94,29.2 VR1.2
  Bottom 0.305: v65.34,10.16 69.15,6.35 v70,6.35
  Bottom 0.406: C3.- 53.4,3.81 11.43,3.81 3.81,11.43 v3.81,13.97
  Bottom 5.08: MTR.2 CHARGE.2 64.83,29.57 C3.-
N$1
  Top 0.305: R1.1 68.25,7.07 D1.A
N$2  (via drill 0.35)
  Top 0.406: U$37.3 U$37.8 v41.91,25.4 | v41.91,34.29 U$29.C U$29.C2
  Bottom 0.406: v41.91,25.4 v41.91,34.29
N$3
  Top 0.305: U$3.GATE 79.83,8.46 79.75,8.46 79.58,8.28 79.58,4.88 80.26,4.19 82.64,4.19 R12.2 85.13,5.08 C2.2 90.49,5.18 U$1.OUT
N$4  (via drill 0.35)
  Top 0.305: R10.P$2 71.75,15.81 C3.+ 72.33,12.86 R6.2 | U$3.SOURCE 81.72,8.46 81.65,8.46 80.75,7.55 U$2.- 81.28,6.6 U$2.FB | U$3.SOURCE 82.23,14.86 C1.- | R6.2 R8.1 | R6.2 70.91,11.43 74.93,11.43 75.36,10.99 75.36,7.17 U$4.IN+ | R3.1 92.39,10.06 U$1.IN- 92.39,8.57 91.44,7.62 89.78,7.62 D2.C v87.78,6.35 | v83.06,10.16 82.23,9.33 U$3.SOURCE
  Top 5.08: C3.+ C1.-
  Bottom 0.305: v87.78,6.35 86.87,6.35 v83.06,10.16
N$5
  Top 0.305: R2.1 89.74,9.31 R3.2 90.59,8.92 U$1.V+
N$6  (via drill 0.35)
  Top 0.305: U$1.V- 91.73,6.12 91.73,5.79 92.29,5.24 C2.1 92.29,4.66 v91.44,3.81 | v85.09,12.7 84.33,11.94 R5.2
  Bottom 0.305: v91.44,3.81 85.09,10.16 v85.09,12.7
N$7
  Top 0.305: R4.2 R5.1 82.57,7.55 U$2.+
N$8  (via drill 0.35)
  Top 0.406: U$36.3 U$36.8 v50.8,25.4 | U$34.C2 U$34.C v50.8,34.29
  Bottom 0.406: v50.8,25.4 52.07,25.4 53.34,26.67 53.34,31.75 v50.8,34.29
N$9
  Top 0.305: U$6.GATE 62.05,8.46 61.97,8.46 61.8,8.28 61.8,5.37 62.92,4.25 62.94,4.25 62.99,4.19 64.02,4.19 64.25,4.42 64.25,4.44 65.19,5.37 R1.2 67.09,5.08 C4.2 72.71,5.18 U$4.OUT
N$10  (via drill 0.35)
  Top 0.406: R65.1 27.52,17.78 v27.94,17.78 | v29.21,30.48 30.48,31.75 v45.72,31.75 | v46.99,34.29 46.99,34.81 U$34.B
  Bottom 0.406: v27.94,17.78 29.21,19.05 v29.21,30.48 | v45.72,31.75 45.72,33.02 v46.99,34.29
N$11
  Top 0.305: R6.1 72.22,9.31 U$4.V+ 72.71,10.06 R7.2
N$12  (via drill 0.35)
  Top 0.305: U$4.V- 73.66,5.93 C4.1 73.66,4.23 v73.66,3.81 | v67.31,12.19 67.31,12.03 R9.2
  Bottom 0.305: v73.66,3.81 67.31,10.16 v67.31,12.19
N$13
  Top 0.305: R8.2 R9.1 64.53,7.55 U$5.+
N$14  (via drill 0.35)
  Top 0.305: U$6.DRAIN v63.5,10.16 | v69.85,20.32 R10.P$1
  Bottom 0.305: v63.5,10.16 65.73,12.39 66.01,12.39 69.85,16.24 v69.85,20.32
N$15  (via drill 0.35)
  Top 0.305: R11.P$1 v85.09,20.32 | v81.28,10.16 U$3.DRAIN
  Bottom 0.305: v85.09,20.32 85.09,13.97 v81.28,10.16
N$16
  Top 0.305: R12.1 85.52,7.58 D2.A
N$17  (via drill 0.35)
  Top 0.406: R63.1 v24.13,17.78 | v29.21,35.56 29.97,36.32 U$28.B
  Bottom 0.406: v24.13,17.78 24.13,30.48 v29.21,35.56
N$18
  Top 0.305: U$9.GATE 97.61,8.46 97.53,8.46 97.36,8.28 97.36,5.37 98.48,4.25 98.62,4.25 98.68,4.19 99.58,4.19 99.81,4.42 99.81,4.44 100.88,5.5 R18.2 102.66,5.08 C6.2 108.27,5.18 U$7.OUT
N$19  (via drill 0.35)
  Top 0.305: R11.P$2 89.53,15.81 C1.+ 90.11,12.22 R2.2 | U$9.SOURCE 100.01,14.86 C5.- | U$9.SOURCE 99.5,8.46 99.43,8.46 98.53,7.55 U$8.- 99.06,6.6 U$8.FB | R4.1 R2.2 | R2.2 88.94,10.96 92.97,10.96 93.14,10.79 93.14,8.29 92.39,7.54 U$1.IN+ | R14.1 110.17,10.06 U$7.IN- 108.58,7.22 107.79,7.22 106.92,6.35 D3.C v105.56,6.35 | U$9.SOURCE v101.08,10.03 v101.09,10.03
  Top 5.08: C1.+ C5.-
  Bottom 0.305: v101.09,10.03 104.78,6.35 v105.56,6.35
N$20
  Top 0.305: R14.2 108.27,10.06 U$7.V+ 108.03,9.06 R13.1
N$21  (via drill 0.35)
  Top 0.305: U$7.V- 109.52,6.12 109.52,5.79 110.07,5.24 C6.1 110.07,4.66 v109.22,3.81 | v103,12.06 103,11.52 R16.2
  Bottom 0.305: v109.22,3.81 103,10.03 v103,12.06
N$22
  Top 0.305: R15.2 R16.1 100.73,7.55 U$8.+
N$23  (via drill 0.35)
  Top 0.406: R62.1 29.97,20.83 v30.48,20.32 | v44.45,13.97 44.91,13.51 U$37.5
  Bottom 0.406: v30.48,20.32 38.1,20.32 v44.45,13.97
N$24
  Top 0.305: R18.1 103.68,7.2 D3.A
N$25
  Top 0.406: U$38.13 R64.1 R62.2
N$26
  Top 0.305: U$10.OUT 126.05,5.18 C8.2 120.18,5.08 R24.2 118.67,5.5 117.42,4.25 116.26,4.25 115.14,5.37 115.14,8.28 115.31,8.46 115.39,8.46 U$12.GATE
N$27  (via drill 0.35)
  Top 0.305: R17.P$2 107.31,15.81 C5.+ 107.89,12.22 R13.2 | U$12.SOURCE 117.28,8.46 117.21,8.46 116.31,7.55 U$11.- 116.84,6.6 U$11.FB | U$12.SOURCE 117.79,14.86 C7.- | R13.2 R15.1 | R13.2 107.1,11.43 | U$7.IN+ 110.92,7.17 110.92,10.79 110.49,11.22 106.89,11.22 R13.2 | R20.1 127.95,10.06 U$10.IN- 126.36,7.22 125.57,7.22 124.7,6.35 D4.C v123.34,6.35 | U$12.SOURCE 118.74,9.91 v118.81,9.91
  Top 5.08: C5.+ C7.-
  Bottom 0.305: v118.81,9.91 122.37,6.35 v123.34,6.35
N$28
  Top 0.305: R20.2 126.05,10.06 U$10.V+ 125.81,9.06 R19.1
N$29  (via drill 0.35)
  Top 0.305: U$10.V- 127.3,6.12 127.3,5.79 127.85,5.24 C8.1 127.85,4.66 v127,3.81 | v120.65,12.06 119.76,11.18 R22.2
  Bottom 0.305: v127,3.81 120.65,10.16 v120.65,12.06
N$30
  Top 0.305: R21.2 R22.1 118.25,7.55 U$11.+
N$31  (via drill 0.35)
  Top 0.305: U$12.DRAIN v116.84,10.16 | v120.65,20.32 R23.P$1
  Bottom 0.305: v116.84,10.16 120.65,13.97 v120.65,20.32
N$32
  Top 0.305: R24.1 121.46,7.2 D4.A
N$33
  Top 0.406: R63.2 U$38.12
N$34
  Top 0.305: U$15.GATE 133.16,8.46 133.09,8.46 132.91,8.28 132.91,5.37 134.04,4.25 135.2,4.25 136.45,5.5 R30.2 138.22,5.08 C10.2 143.83,5.18 U$13.OUT
N$35  (via drill 0.35)
  Top 0.305: R23.P$2 125.09,15.81 C7.+ 125.67,12.47 R19.2 | U$15.SOURCE 135.06,8.46 134.99,8.46 134.09,7.55 U$14.- 134.62,6.6 U$14.FB | R21.1 R19.2 | R19.2 125.27,10.76 125.47,10.96 128.53,10.96 128.71,10.79 128.71,8.29 127.95,7.54 U$10.IN+ | R26.1 145.73,10.06 U$13.IN- 144.13,7.22 143.35,7.22 142.48,6.35 D5.C v141.12,6.35 | U$15.SOURCE v136.39,9.78 v136.4,9.78 | C9.- 135.95,9.34 U$15.SOURCE
  Top 5.08: C7.+ C9.-
  Bottom 0.305: v136.4,9.78 139.83,6.35 v141.12,6.35
N$36
  Top 0.305: R25.1 143.72,8.93 U$13.V+ 143.83,10.06 R26.2
N$37  (via drill 0.35)
  Top 0.305: U$13.V- 144.78,5.93 C10.1 145.63,4.66 v144.78,3.81 | v138.43,11.43 137.63,10.63 R28.2
  Bottom 0.305: v144.78,3.81 138.43,10.16 v138.43,11.43
N$38
  Top 0.305: U$14.+ 136.07,8.05 136.15,8.05 137.02,8.93 R28.1 R27.2
N$39  (via drill 0.35)
  Top 0.305: U$15.DRAIN v134.62,10.16 | v138.43,20.32 R29.P$1
  Bottom 0.305: v134.62,10.16 138.43,13.97 v138.43,20.32
N$40
  Top 0.305: R30.1 139.24,7.2 D5.A
N$41
  Top 0.406: D10.C 6.31,18.33 C19.1 6.31,22.96 VR1.1 6.41,22.86 R66.2 | 6.35,18.03 D10.C | U$38.3 6.87,17.78 D10.C
N$42
  Top 0.305: C12.2 135.57,43.08 | 135.57,43.08 U$16.OUT | U$18.GATE 146.24,39.8 146.31,39.8 146.49,39.98 146.49,42.89 145.36,44.02 144.2,44.02 142.95,42.76 R36.2 135.89,42.76 135.57,43.08
N$43  (via drill 0.35)  (1 unrouted)
  Top 0.305: R29.P$2 142.88,15.81 C9.+ 143.45,12.22 R25.2 | U$18.SOURCE 144.34,39.8 144.41,39.8 145.31,40.71 U$17.- 145.73,40.96 144.78,41.91 U$17.FB | U$18.SOURCE 143.83,33.4 C11.- | R27.1 R25.2 | U$13.IN+ 145.73,7.54 146.49,8.29 146.49,10.79 146.31,10.96 143.25,10.96 142.92,10.63 R25.2 | U$16.IN- 135.26,41.03 136.05,41.03 136.92,41.91 D6.C v138.28,41.91 | U$18.SOURCE 143,38.47 v143,38.1
  Top 5.08: C9.+ 146.05,15.24 arc90 148.59,17.78 148.59,30.48 arc90 146.05,33.02 C11.-
  Bottom 0.305: v143,38.1 142.09,38.1 v138.28,41.91
N$44
  Top 0.305: R31.1 137.05,39.44 U$16.V+ 135.57,38.2 R32.2
N$45  (via drill 0.35)
  Top 0.305: U$16.V- 134.62,42.33 C12.1 133.77,43.6 v134.62,44.45 | v140.97,36.83 141.39,37.25 R34.2
  Bottom 0.305: v134.62,44.45 140.97,38.1 v140.97,36.83
N$46
  Top 0.305: R33.2 R34.1 143.62,40.71 U$17.+
N$47  (via drill 0.35)
  Top 0.305: U$18.DRAIN v144.78,38.1 | v140.97,27.94 R35.P$1
  Bottom 0.305: v144.78,38.1 140.97,34.29 v140.97,27.94
N$48
  Top 0.305: R36.1 140.16,41.06 D6.A
N$49
  Top 0.406: R65.2 U$38.11
N$50
  Top 0.305: U$19.OUT 117.79,43.08 C14.2 123.41,43.18 R42.2 125.17,42.76 126.42,44.02 127.58,44.02 128.71,42.89 128.71,39.98 128.53,39.8 128.46,39.8 U$21.GATE
N$51  (via drill 0.35)  (1 unrouted)
  Top 0.305: R35.P$2 136.53,32.45 C11.+ 135.95,35.66 R31.2 | U$21.SOURCE 126.56,39.8 126.63,39.8 127.53,40.71 U$20.- 127.95,40.96 127,41.91 127,43.18 | U$21.SOURCE 126.05,33.4 C13.- | R31.2 133.14,37.25 132.91,37.47 132.91,38.73 133.01,38.83 133.01,41.19 U$16.IN+ | R33.1 R31.2 | R38.1 115.89,38.2 U$19.IN- 117.48,41.03 118.27,41.03 119.14,41.91 D7.C v120.5,41.91 | v125.22,38.1 126.05,38.93 U$21.SOURCE
  Top 5.08: C13.- C11.+
  Bottom 0.305: v120.5,41.91 121.41,41.91 v125.22,38.1
N$52
  Top 0.305: R38.2 117.79,38.2 U$19.V+ 118.28,38.95 R37.1
N$53  (via drill 0.35)
  Top 0.305: U$19.V- 116.55,42.13 116.55,42.47 115.99,43.02 C14.1 116.84,44.03 v116.84,44.45 | v123.19,36.07 123.19,36.49 R40.2
  Bottom 0.305: v116.84,44.45 123.19,38.1 v123.19,36.07
N$54
  Top 0.305: R39.2 R40.1 124.22,38.95 125.47,40.2 125.55,40.2 U$20.+
N$55  (via drill 0.35)
  Top 0.305: R41.P$1 v123.19,27.94 | v127,38.1 U$21.DRAIN
  Bottom 0.305: v123.19,27.94 123.19,34.29 v127,38.1
N$56
  Top 0.305: R42.1 122.38,41.06 D7.A
N$57  (via drill 0.35)
  Top 0.406: U$35.3 U$35.8 v33.02,25.4 | U$28.C2 U$28.C v33.02,34.29
  Bottom 0.406: v33.02,34.29 v33.02,25.4
N$58
  Top 0.305: U$22.OUT 100.01,43.08 C16.2 106.26,43.18 R48.2 107.39,42.76 108.64,44.02 109.8,44.02 110.92,42.89 110.92,39.98 110.75,39.8 110.67,39.8 U$24.GATE
N$59  (via drill 0.35)
  Top 0.305: R41.P$2 118.75,32.45 C13.+ 118.17,36.04 R37.2 | U$23.FB 109.22,41.66 U$23.- 109.67,40.2 109.59,40.2 108.69,39.3 U$24.SOURCE | U$24.SOURCE 107.89,38.92 C15.- | R37.2 R39.1 | U$19.IN+ 115.14,41.09 115.14,37.47 115.36,37.25 R37.2 | R44.1 98.11,38.2 U$22.IN- 99.7,41.03 100.49,41.03 101.36,41.91 D8.C v102.72,41.91 | v107.19,37.97 108.27,39.05 U$24.SOURCE
  Top 5.08: C15.- C13.+
  Bottom 0.305: v102.72,41.91 106.65,37.97 v107.19,37.97
N$60
  Top 0.305: R44.2 99.91,39.34 U$22.V+ 100.63,38.82 R43.1
N$61  (via drill 0.35)
  Top 0.305: U$22.V- 99.06,42.33 C16.1 99.06,44.03 v99.06,44.45 | v105.03,36.07 106.05,37.08 R46.2
  Bottom 0.305: v99.06,44.45 99.06,43.69 105.03,37.72 v105.03,36.07
N$62
  Top 0.305: R45.2 R46.1 106.05,39.06 107.19,40.2 107.77,40.2 U$23.+
N$63  (via drill 0.35)
  Top 0.305: U$24.DRAIN v109.22,38.1 | v105.41,27.94 R47.P$1
  Bottom 0.305: v109.22,38.1 105.41,34.29 v105.41,27.94
N$64
  Top 0.305: R48.1 104.6,41.06 D8.A
N$65  (via drill 0.35)
  Top 0.406: R64.2 v27.94,19.05 | v38.1,35.56 38.86,36.32 U$29.B
  Bottom 0.406: v27.94,19.05 27.94,31.75 31.75,35.56 v38.1,35.56
N$66
  Top 0.305: U$25.OUT 82.23,43.08 C18.2 87.97,43.18 R54.2 89.61,42.76 90.86,44.02 92.02,44.02 93.14,42.89 93.14,39.98 92.97,39.8 92.89,39.8 U$27.GATE
N$67  (via drill 0.35)  (1 unrouted)
  Top 0.305: R47.P$2 100.97,32.45 C15.+ | U$27.SOURCE 91,39.8 91.07,39.8 91.97,40.71 U$26.- 91.44,41.66 U$26.FB | U$27.SOURCE 90.49,33.4 C17.- | R45.1 R43.2 97.71,37.12 97.36,37.47 97.36,41.09 U$22.IN+ | R50.1 80.33,38.2 U$25.IN- 80.33,39.69 81.28,40.64 82.94,40.64 D9.C v84.94,41.91 | U$27.SOURCE 90.49,38.67 v89.92,38.1
  Top 5.08: C17.- C15.+
  Bottom 0.305: v89.92,38.1 88.75,38.1 v84.94,41.91
N$68
  Top 0.305: R50.2 82.23,38.2 U$25.V+ 84.06,39.44 R49.1
N$69  (via drill 0.35)
  Top 0.305: U$25.V- 81.28,42.33 C18.1 81.28,44.03 v81.28,44.45 | v87.63,36.83 87.63,37 R52.2
  Bottom 0.305: v81.28,44.45 87.63,38.1 v87.63,36.83
N$70
  Top 0.305: R51.2 R52.1 89.17,39.46 89.91,40.2 89.98,40.2 U$26.+
N$71  (via drill 0.35)
  Top 0.305: U$27.DRAIN v91.44,38.1 | v87.63,27.94 R53.P$1
  Bottom 0.305: v91.44,38.1 87.63,34.29 v87.63,27.94
N$72
  Top 0.305: D9.A 86.82,41.06 R54.1
N$73  (via drill 0.35)
  Top 0.406: v34.29,17.78 34.52,18.01 U$35.7 34.52,25.63 v35.56,26.67 | v25.4,15.24 R55.2 | v40.64,26.67 41.91,26.67 | 41.91,26.67 43.41,25.17 U$37.7 | 41.91,26.67 v46.99,26.67 | v50.8,26.67 52.3,25.17 U$36.7
  Bottom 0.406: v34.29,17.78 31.75,15.24 v25.4,15.24 | v35.56,26.67 v40.64,26.67 | v46.99,26.67 v50.8,26.67
N$74  (via drill 0.35)
  Top 0.406: U$35.6 38.21,21.59 v40.64,21.59 | v43.18,21.59 44.45,21.59 | 44.45,21.59 v49.53,21.59 | U$36.6 53.8,23.28 52.95,22.42 52.9,22.42 v52.07,21.59 55.88,17.78 55.88,10.16 49.53,3.81 18.2,3.81 R56.2 | U$37.6 44.91,22.05 44.45,21.59
  Bottom 0.406: v40.64,21.59 v43.18,21.59 | v49.53,21.59 v52.07,21.59
N$75  (via drill 0.35)
  Top 0.406: U$35.4 34.52,9.12 v34.29,8.89 | v35.56,5.08 v43.18,5.08 46.99,5.08 52.3,10.39 U$36.4 | U$37.4 43.41,9.12 v43.18,8.89 | R57.2 8.04,15.66 v8.89,16.51
  Bottom 0.406: v43.18,8.89 v43.18,5.08 | v34.29,8.89 35.56,7.62 v35.56,5.08 20.32,5.08 v8.89,16.51
N$76  (via drill 0.35)
  Top 0.406: U$36.2 49.3,9.93 45.72,6.35 v40.64,6.35 v33.02,6.35 17.78,6.35 v16.51,7.62 | v31.75,8.89 31.52,9.12 U$35.2 | U$37.2 40.64,11.55 v40.64,8.89 | R58.2 10.58,7.62 v12.7,7.62
  Bottom 0.406: v33.02,6.35 31.75,7.62 v31.75,8.89 | v40.64,8.89 v40.64,6.35 | v12.7,7.62 v16.51,7.62
N$77
  Top 0.406: U$35.1 30.02,11.43 | 30.02,11.43 30.02,9.35 31.75,7.62 36.83,7.62 | U$36.1 47.8,9.7 45.72,7.62 36.83,7.62 | U$37.1 38.91,9.7 36.83,7.62 | R59.2 23.71,11.43 30.02,11.43
N$78  (via drill 0.35)
  Top 0.406: R60.2 31.52,19.24 U$35.9 31.52,26.44 33.02,27.94 v35.56,27.94 | U$37.9 40.41,25.63 v38.1,27.94 v46.99,27.94 | v49.53,27.94 49.53,24.01 U$36.9
  Bottom 0.406: v35.56,27.94 v38.1,27.94 | v46.99,27.94 v49.53,27.94
N$79
  Top 0.406: R61.2 12.64,23.78 U$35.10 30.02,27.48 31.75,29.21 35.56,29.21 | U$36.10 47.8,28.4 46.99,29.21 35.56,29.21 | U$37.10 38.91,25.86 35.56,29.21
N$81
  Top 0.406: R72.1 4.7,36.74 R67.2 6.25,36.77 3.3V_BUCK.4
N$82
  Top 0.406: 3.3V_BUCK.8 13.62,31.82 C20.1
N$83
  Top 0.406: 3.3V_BUCK.6 9.53,30.27 R70.2
N$84  (via drill 0.35)
  Top 0.406: C22.1 9.53,38.1 | 9.53,38.1 3.3V_BUCK.3 | 9.53,38.1 9.54,38.11 v10.15,38.11 | v11.43,43.18 C24.1
  Bottom 0.406: v10.15,38.11 10.15,41.9 v11.43,43.18
N$85
  Top 0.406: C22.2 R71.2
SW
  Top 0.406: U$39.P$1 16.7,34.09 D11.C 14,33.9 C20.2 13.97,34.86 3.3V_BUCK.1 14.1,36.77 U$39.P$1
VCC  (via drill 0.35)
  Top 0.305: R53.P$2 83.19,32.45 C17.+ 82.61,36.29 R49.2 | R49.2 R51.1 | U$25.IN+ 80.33,40.72 79.58,39.97 79.58,37.47 79.75,37.3 82.81,37.3 83.27,37.76 R49.2
  Top 0.406: 12.7,40.98 R68.2 13.76,40.85 v13.97,40.64 | 3.3V_BUCK.7 10.79,29 C23.1 11.43,28.36 v11.43,29.21 | R66.1 10.16,23.28 v10.16,24.13 | MTR.1 66.04,45.72 v16.51,45.72
  Top 5.08: 71.97,33.02 MTR.1 78.74,33.02 | 71.97,33.02 CHARGE.1 76.2,33.86 76.2,34.29 | C17.+ 78.74,33.02 | 71.97,33.02 78.74,33.02
  Bottom 0.406: v10.16,24.13 10.16,27.94 v11.43,29.21 13.97,31.75 v13.97,40.64 16.51,43.18 v16.51,45.72